# Altium schematic sheet 04-BLE.SchDoc: BLE Transreciver
size A3; DocumentNumber: 4; SheetNumber: 4; SheetTotal: 15
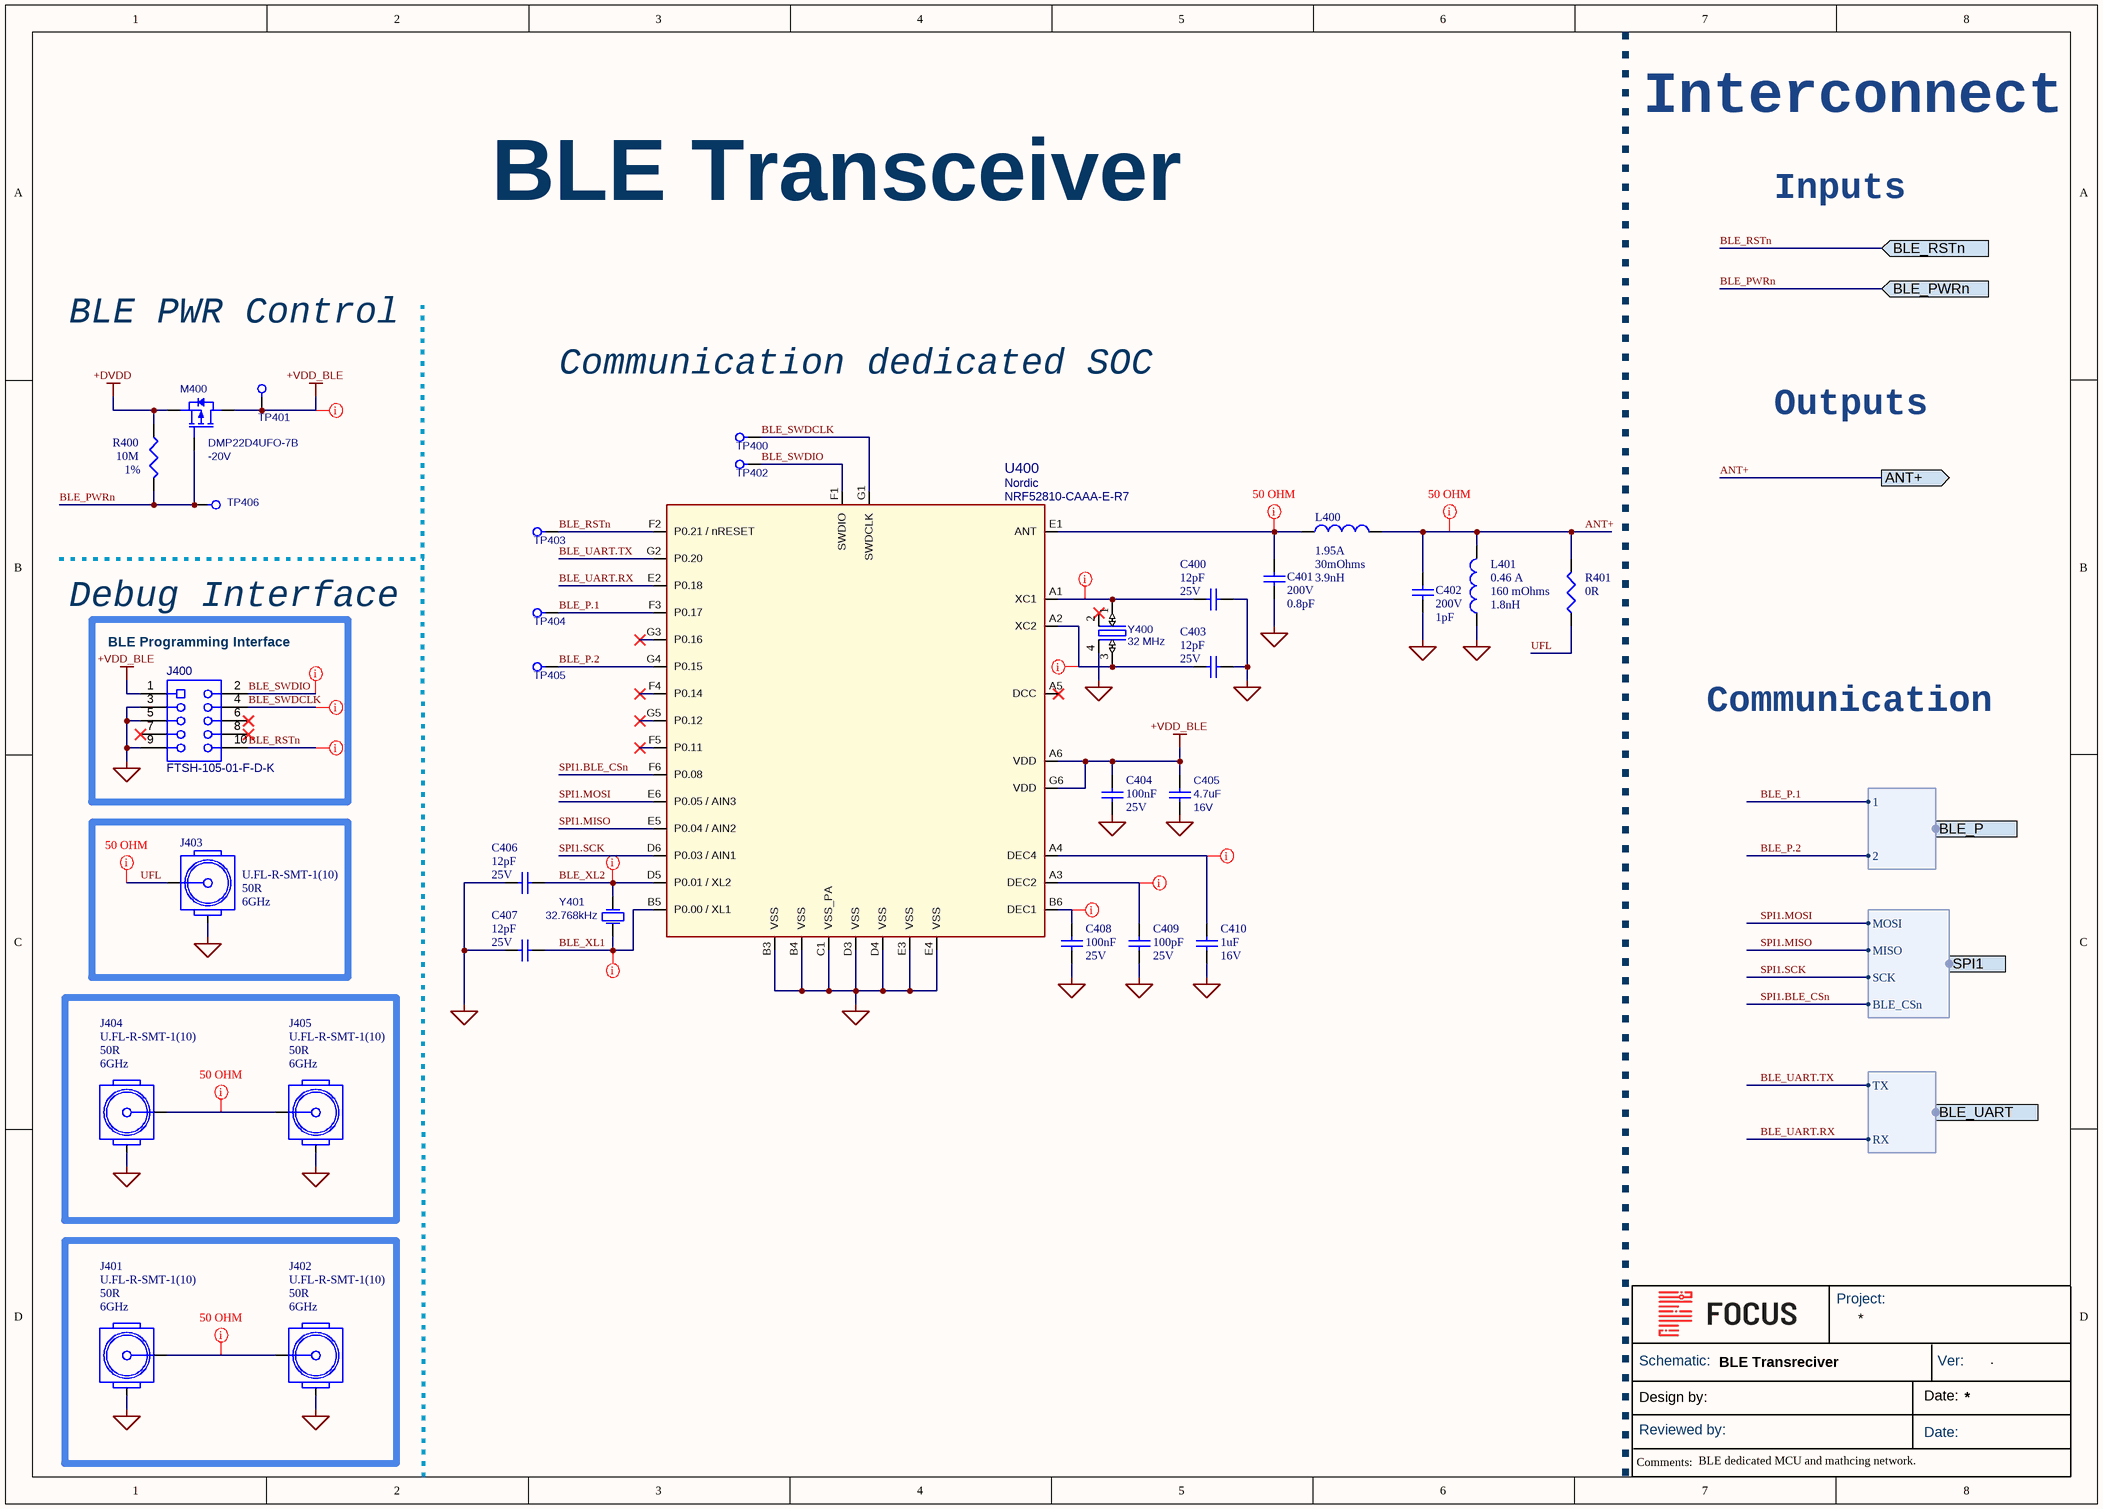
[diagram p0: 04-BLE.SchDoc]

## Parts
C400  value 12pF  Rated DC Voltage (URdc): 25V  [C0201_C]  (hidden comment: GRM0335C1E120JA01D)
C401  value 0.8pF  Voltage Rating: 200V  [CAP0402_REDUCED]  (hidden comment: 600L0R8AT200T)
C402  value 1pF  Voltage Rating: 200V  [CAP0402_REDUCED]  (hidden comment: 600L1R0AT200T)
C403  value 12pF  Rated DC Voltage (URdc): 25V  [C0201_C]  (hidden comment: GRM0335C1E120JA01D)
C404  value 100nF  Rated DC Voltage (URdc): 25V  [C0201_C]  (hidden comment: GRM033R61E104KE14J)
C405  value 4.7uF  Rating: 16V  [CAP0603_REDUCED]  (hidden comment: GRM188R61C475KE11)
C406  value 12pF  Rated DC Voltage (URdc): 25V  [C0201_C]  (hidden comment: GRM0335C1E120JA01D)
C407  value 12pF  Rated DC Voltage (URdc): 25V  [C0201_C]  (hidden comment: GRM0335C1E120JA01D)
C408  value 100nF  Rated DC Voltage (URdc): 25V  [C0201_C]  (hidden comment: GRM033R61E104KE14J)
C409  value 100pF  Rated DC Voltage (URdc): 25V  [C0201_C]  (hidden comment: GRM033R71E101KA01D)
C410  value 1uF  Rated DC Voltage (URdc): 16V  [C0201_C]  (hidden comment: GRM033R61C105ME15D)
J400  FTSH-105-01-F-D-K  [SAMTEC_FTSH-105-01-XXX-D-K]
J401  U.FL-R-SMT-1(10)  Characteristic Impedance: 50R  Operating Frequency-Max: 6GHz  [FP-U_FL-R-SMT-1_10-MFG]
J402  U.FL-R-SMT-1(10)  Characteristic Impedance: 50R  Operating Frequency-Max: 6GHz  [FP-U_FL-R-SMT-1_10-MFG]
J403  U.FL-R-SMT-1(10)  Characteristic Impedance: 50R  Operating Frequency-Max: 6GHz  [FP-U_FL-R-SMT-1_10-MFG]
J404  U.FL-R-SMT-1(10)  Characteristic Impedance: 50R  Operating Frequency-Max: 6GHz  [FP-U_FL-R-SMT-1_10-MFG]
J405  U.FL-R-SMT-1(10)  Characteristic Impedance: 50R  Operating Frequency-Max: 6GHz  [FP-U_FL-R-SMT-1_10-MFG]
L400  value 3.9nH  Current Rating: 1.95A  DC Resistance: 30mOhms  [L0402_C]  (hidden comment: LQW15AN3N9G80D)
L401  value 1.8nH  Current Rating: 0.46 A  DC Resistance: 160 mOhms  [L0402_C]  (hidden comment: LQW15AN1N8C00D)
M400  Rating: -20V  [DIODESINC_X2-DFN0604-3]  (hidden comment: DMP22D4UFO-7B)
R400  value 10M  Tolerance: 1%  [R0201_C]  (hidden comment: CRCW020110M0FNED)
R401  value 0R  [R0201_C]  (hidden comment: PA0201-R-070RL)
TP400  Test Point  [testpad_0.9mm]  (value not drawn)  (no BOM)
TP401  Test Point  [testpad_0.9mm]  (value not drawn)  (no BOM)
TP402  Test Point  [testpad_0.9mm]  (value not drawn)  (no BOM)
TP403  Test Point  [testpad_0.9mm]  (value not drawn)  (no BOM)
TP404  Test Point  [testpad_0.9mm]  (value not drawn)  (no BOM)
TP405  Test Point  [testpad_0.9mm]  (value not drawn)  (no BOM)
TP406  Test Point  [testpad_0.9mm]  (value not drawn)  (no BOM)
U400  Manufacturer: Nordic  [NORDIC_WLCSP_2.482x2.464]  (hidden comment: NRF52810-CAAA-E-R7)
Y400  value 32 MHz  [XTAL_ECS-SMD-CRYSTAL-10-48-CKY-TR]  (hidden comment: ECS-320-10-48-CKY-TR)
Y401  value 32.768kHz  [MICROCRYSTAL_CC8V-T1A]  (hidden comment: CM8V-T1A-32.768KHZ-6PF-20PPM-TA-QC)

## Ports
ANT+ (out), BLE_P (harness BLE PINS), BLE_PWRn (in), BLE_RSTn (in), BLE_UART (harness UART), SPI1 (harness BLE_SPI)

## Harnesses
BLE_SPI: MOSI, MISO, BLE_CSn, SCK
BLE PINS: 1, 2
UART: TX, RX

## Nets
+DVDD: M400.2(S) R400.1
+VDD_BLE: C404.2 C405.1 J400.1 M400.3(D) TP401.1 U400.A6(VDD) U400.G6(VDD)
GND: C400.2 C401.1 C402.1 C403.2 C404.1 C405.2 C406.1 C407.1 C408.1 C409.1 C410.2 J400.3 J400.5 J400.9 J401.2 J402.2 J403.2 J404.2 J405.2 L401.1 U400.B3(VSS) U400.B4(VSS) U400.C1(VSS_PA) U400.D3(VSS) U400.D4(VSS) U400.E3(VSS) U400.E4(VSS) Y400.4(GND)
ANT+: C402.2 L400.2 L401.2 R401.2 ; port ANT+
BLE_P.1: TP404.1 U400.F3(P0.17) ; port BLE_P.1
BLE_P.2: TP405.1 U400.G4(P0.15) ; port BLE_P.2
BLE_PWRn: M400.1(G) R400.2 TP406.1 ; port BLE_PWRn
BLE_RSTn: J400.10 TP403.1 U400.F2(P0.21_/_nRESET) ; port BLE_RSTn
BLE_SWDCLK: J400.4 TP400.1 U400.G1(SWDCLK)
BLE_SWDIO: J400.2 TP402.1 U400.F1(SWDIO)
BLE_UART.RX: U400.E2(P0.18) ; port BLE_UART.RX
BLE_UART.TX: U400.G2(P0.20) ; port BLE_UART.TX
BLE_XL1: C407.2 U400.B5(P0.00_/_XL1) Y401.1
BLE_XL2: C406.2 U400.D5(P0.01_/_XL2) Y401.2
SPI1.BLE_CSn: U400.F6(P0.08) ; port SPI1.BLE_CSn
SPI1.MISO: U400.E5(P0.04_/_AIN2) ; port SPI1.MISO
SPI1.MOSI: U400.E6(P0.05_/_AIN3) ; port SPI1.MOSI
SPI1.SCK: U400.D6(P0.03_/_AIN1) ; port SPI1.SCK
UFL: J403.1 R401.1
NetC400_1: C400.1 U400.A1(XC1) Y400.1(IN/OUT)
NetC401_2: C401.2 L400.1 U400.E1(ANT)
NetC403_1: C403.1 U400.A2(XC2) Y400.3(OUT/IN)
NetC408_2: C408.2 U400.B6(DEC1)
NetC409_2: C409.2 U400.A3(DEC2)
NetC410_1: C410.1 U400.A4(DEC4)
NetJ401_1: J401.1 J402.1
NetJ404_1: J404.1 J405.1

Not connected (* = marked no-connect by the designer): J400 6* 7* 8*; U400 A5(DCC)* F4(P0.14)* F5(P0.11)* G3(P0.16)* G5(P0.12)*; Y400 2(NC)*

## Layout directives
net class 50_OHM; rule Impedance Constraint [Min = 50.00    Max = 50.00    ]: ANT+, NetC401_2, NetJ401_1, NetJ404_1, UFL
net class DIGITAL: BLE_RSTn, BLE_SWDCLK, BLE_SWDIO, BLE_XL1, BLE_XL2, NetC400_1, NetC403_1
rule Supply Nets [Voltage = 3.300]; net class POWER: +VDD_BLE, NetC408_2, NetC409_2, NetC410_1

## Notes on the sheet
- Interconnect
- BLE Transceiver
- Inputs
- BLE PWR Control
- Communication dedicated SOC
- Outputs
- Debug Interface
- (near J400) BLE Programming Interface
- Communication
- BLE dedicated MCU and mathcing network.
- Project:
- Schematic:
- Ver:
- .
- Design by:
- Reviewed by:
- Date:
- Comments:

## Library data of the parts
C400 C403 C406 C407 = GRM0335C1E120JA01D: Ceramic Capacitor, Multilayer, Ceramic, 25V, 5% +Tol, 5% -Tol, C0G, 30ppm/Cel TC, 0.000012uF, Surface Mount, 0201; Manufacturer: Murata; Multilayer: Yes; Category: Ceramic Capacitors; Supplier: Digikey; Supplier Part Number: 490-3144-1-ND; Manufacturer Part Number: GRM0335C1E120JA01D; RoHS: Yes; Stock: 4384132; Pricing: 1=0,1, 10=0,011, 50=0,0062, 100=0,0048, 500=0,0036, 1000=0,00283, 2500=0,00258, 5000=0,00237 (USD); Mounting Technology: Surface Mount; Pins: 2; Dielectric Material: Ceramic; Package Shape: Rectangular; Case/Package: 0201; Terminal Finish: Nickel; Min Operating Temperature: -55°C; Max Operating Temperature: 125°C; Termination: Wraparound; JESD-609 Code: e3; Capacitor Type: Ceramic; Tolerance  (fill in as +-): 5%; Packaging: Tape and Reel; Tolerance (fill in as +-): 5%; Temperature Characteristics Code: C0G; Reach SVHC Compliant: Yes; RoHS Compliant: Yes; ComponentLink1URL: https://datasheet.ciiva.com:443/pdfs/VipMasterIC/IC/MURE/MURE-S-A0004347008/MURE-S-A0004348737-1.pdf?src-supplier=IHS+Markit; ComponentLink1Description: https://datasheet.ciiva.com:443/pdfs/VipMasterIC/IC/MURE/MURE-S-A0004347008/MURE-S-A0004348737-1.pdf?src-supplier=IHS+Markit; Supplier 1: Arrow Electronics; Supplier Part Number 1: GRM0335C1E120JA01D
C401 = 600L0R8AT200T: Capacitor, 0.8pF, Silicon RF, 200V, Tolerance 0.05pF, 0402, Implant-grade; Manufacturer: Kyocera AVX; Medical Grade Manufacturer: TBD; Temperature Coefficient: 30 ppm/°C; Category: Capacitor; Manufacturer Part Number: 600L0R8AT200T; Medical Grade Manufacturer Part Number: TBD; Size Code: 0402; Supplier: TBD; Supplier Part Number: TBD; Height: 0.6mm; Width: 0.51mm; Length: 1.05mm; Tolerance: 0.05pF; Dielectric: -; Supplier 1: Mouser; Supplier Part Number 1: 581-600L0R8AT
C402 = 600L1R0AT200T: Capacitor, 1pF, RF Capacitors, 200V, Tolerance 0.01pF, 0402, Implant-grade; Manufacturer: Kyocera AVX; Medical Grade Manufacturer: TBD; Temperature Coefficient: 30 ppm/°C; Category: Capacitor; Manufacturer Part Number: 600L1R0AT200T; Medical Grade Manufacturer Part Number: TBD; Size Code: 0402; Supplier: TBD; Supplier Part Number: TBD; Height: 0.6mm; Width: 0.51mm; Length: 1.02mm; Tolerance: 0.01pF; Dielectric: -; Supplier 1: Mouser; Supplier Part Number 1: 581-600L1R0AT
C404 C408 = GRM033R61E104KE14J: Ceramic Capacitor, Multilayer, Ceramic, 25V, 10% +Tol, 10% -Tol, X5R, 15% TC, 0.1uF, Surface Mount, 0201; Manufacturer: Murata; Multilayer: Yes; Category: Ceramic Capacitors; Supplier: Digikey; Supplier Part Number: 490-14571-1-ND; Manufacturer Part Number: GRM033R61E104KE14J; RoHS: Yes; Stock: 1540851; Pricing: 1=0,1, 10=0,033, 50=0,0192, 100=0,0148, 500=0,01118, 1000=0,00878, 2500=0,00798, 5000=0,00734 (USD); Mounting Technology: Surface Mount; Pins: 2; Dielectric Material: Ceramic; Package Shape: Rectangular; Case/Package: 0201; Terminal Finish: Nickel; Min Operating Temperature: -55°C; Max Operating Temperature: 85°C; JESD-609 Code: e3; Capacitor Type: Ceramic; Tolerance  (fill in as +-): 10%; Package Style: SMTMeter; Packaging: Tape and Reel; Tolerance (fill in as +-): 10%; Temperature Characteristics Code: X5R; Termination: Wraparound; Length: 0.6mm; Width: 0.3mm; Height: 0.3mm; Reach SVHC Compliant: Yes; RoHS Compliant: Yes; ComponentLink1URL: https://psearch.en.murata.com:443/capacitor/product/GRM033R61E104KE14%23.pdf?src-supplier=IHS+Markit; ComponentLink1Description: https://psearch.en.murata.com:443/capacitor/product/GRM033R61E104KE14%23.pdf?src-supplier=IHS+Markit; ComponentLink2URL: http://www.mouser.com/ds/2/281/c02e-2905.pdf?src-supplier=Mouser; ComponentLink2Description: http://www.mouser.com/ds/2/281/c02e-2905.pdf?src-supplier=Mouser; ComponentLink3URL: http://search.murata.co.jp/Ceramy/image/img/A01X/G101/ENG/GRM033R61E104KE14-01.pdf?src-supplier=Digikey; ComponentLink3Description: http://search.murata.co.jp/Ceramy/image/img/A01X/G101/ENG/GRM033R61E104KE14-01.pdf?src-supplier=Digikey; ComponentLink4URL: https://search.murata.co.jp/Ceramy/image/img/A01X/G101/ENG/GRM033R61E104KE14-01.pdf?src-supplier=Digikey; ComponentLink4Description: https://search.murata.co.jp/Ceramy/image/img/A01X/G101/ENG/GRM033R61E104KE14-01.pdf?src-supplier=Digikey; Supplier 1: Arrow Electronics; Supplier Part Number 1: GRM033R61E104KE14J
C405 = GRM188R61C475KE11: Capacitor, 4.7uF, X5R, 16V, 10%, 0603, Implant-grade; Manufacturer: Murata; Medical Grade MFR PN: GCH188R61C475KE11; Length (mm): 1.60 ±0.10; Medical Grade MFR: Murata; PCB Footprint: cap0603_reduced; Thickness (mm): 0.80 ±0.10; Width (mm): 0.80 ±0.10; Category: Capacitor; Package Description: 0603; Check: *; Supplier 1: Arrow Electronics; Supplier Part Number 1: GRM188R61C475KE11D; Status: *; Review: *; Manufacturer Part Number: GRM188R61C475KE11
C409 = GRM033R71E101KA01D: Ceramic Capacitor, Multilayer, Ceramic, 25V, 10% +Tol, 10% -Tol, X7R, 15% TC, 0.0001uF, Surface Mount, 0201; Manufacturer: Murata; Multilayer: Yes; Category: Ceramic Capacitors; Supplier: Digikey; Supplier Part Number: 490-3172-1-ND; Manufacturer Part Number: GRM033R71E101KA01D; RoHS: Yes; Stock: 605708; Pricing: 1=0,1, 10=0,01, 50=0,0056, 100=0,0043, 500=0,00324, 1000=0,00255, 2500=0,00232, 5000=0,00213 (USD); Mounting Technology: Surface Mount; Pins: 2; Dielectric Material: Ceramic; Package Shape: Rectangular; Case/Package: 0201; Terminal Finish: Nickel; Min Operating Temperature: -55°C; Max Operating Temperature: 125°C; JESD-609 Code: e3; Capacitor Type: Ceramic; Tolerance  (fill in as +-): 10%; Package Style: SMTMeter; Packaging: Tape and Reel; Tolerance (fill in as +-): 10%; Temperature Characteristics Code: X7R; Termination: Wraparound; Length: 0.6mm; Width: 0.3mm; Height: 0.3mm; Reach SVHC Compliant: Yes; RoHS Compliant: Yes; ComponentLink1URL: https://psearch.en.murata.com:443/capacitor/product/GRM033R71E101KA01%23.pdf?src-supplier=IHS+Markit; ComponentLink1Description: https://psearch.en.murata.com:443/capacitor/product/GRM033R71E101KA01%23.pdf?src-supplier=IHS+Markit; ComponentLink2URL: https://datasheet.ciiva.com/129/grm033r71e101ka01-01-129915.pdf?src-supplier=Digikey; ComponentLink2Description: https://datasheet.ciiva.com/129/grm033r71e101ka01-01-129915.pdf?src-supplier=Digikey; ComponentLink3URL: https://datasheet.ciiva.com/129/grm033r71e101ka01-01-129916.pdf?src-supplier=Digikey; ComponentLink3Description: https://datasheet.ciiva.com/129/grm033r71e101ka01-01-129916.pdf?src-supplier=Digikey; ComponentLink4URL: https://datasheet.ciiva.com/129/grm033r71e101ka01-01-129917.pdf?src-supplier=Digikey; ComponentLink4Description: https://datasheet.ciiva.com/129/grm033r71e101ka01-01-129917.pdf?src-supplier=Digikey; ComponentLink5URL: https://datasheet.ciiva.com/18184/getdatasheetpartid-228478-18184102.pdf?src-supplier=Verical; ComponentLink5Description: https://datasheet.ciiva.com/18184/getdatasheetpartid-228478-18184102.pdf?src-supplier=Verical; ComponentLink6URL: https://datasheet.ciiva.com/29199/455792-da-01-en-vs-kondensator-0201-29199171.pdf?src-supplier=Conrad; ComponentLink6Description: https://datasheet.ciiva.com/29199/455792-da-01-en-vs-kondensator-0201-29199171.pdf?src-supplier=Conrad; ComponentLink7URL: https://datasheet.ciiva.com/11605/product-11605541.pdf?src-supplier=Avnet; ComponentLink7Description: https://datasheet.ciiva.com/11605/product-11605541.pdf?src-supplier=Avnet; ComponentLink8URL: https://datasheet.ciiva.com/16370/product-16370826.pdf?src-supplier=Future+Electronics; ComponentLink8Description: https://datasheet.ciiva.com/16370/product-16370826.pdf?src-supplier=Future+Electronics; Supplier 1: Arrow Electronics; Supplier Part Number 1: GRM033R71E101KA01D
C410 = GRM033R61C105ME15D: Ceramic Capacitor, Multilayer, Ceramic, 16V, 20% +Tol, 20% -Tol, X5R, 15% TC, 1uF, Surface Mount, 0201; Manufacturer: Murata; Category: Ceramic Capacitors; Supplier: Digikey; Supplier Part Number: 490-18654-1-ND; Manufacturer Part Number: GRM033R61C105ME15D; RoHS: No; Stock: 132893; Pricing: 1=0,16, 10=0,105, 50=0,0628, 100=0,0493, 500=0,03644, 1000=0,03017, 2500=0,02808, 5000=0,02569 (USD); Supplier 1: Avnet; Supplier Part Number 1: GRM033R61C105ME15D
J400 = FTSH-105-01-F-D-K: Connector, 1.27 mm, 2x5, Male, TH; Manufacturer: Samtec; Review: 020823; Value: FTSH-105-01-F-D-K; Supplier 1: Mouser; Supplier Part Number 1: 200-FTSH10501FDK; Status: Approved; Manufacturer Part Number: FTSH-105-01-F-D-K
J401-J405 = U.FL-R-SMT-1(10): RF Connector, 1 Contact(s), Male, Board Mount, Surface Mount Terminal, Receptacle; pin to pad: 2>2+3; Manufacturer: Hirose; Durability: 30Cycles; Insulation Resistance: 500MR; Number of Ports: 1; Option: General Purpose; Contact Resistance: 20mR; Contact Style: Coax; Coupling Type: Snap; Dielectric Withstanding Voltage (AC): 200V; Filter Feature: No; Mating Information: MULTIPLE MATING PARTS AVAILABLE; Panel Mount: No; VSWR: 1.5; Insertion Loss: 0.05dB; Body Depth: 0.098inch; Mounting Option 1: LOCKING; Body Diameter: 0.079inch; Reference Standard: UL; Reliability: COMMERCIAL; Supplier: Digi-Key; Supplier Part Number: H11891CT-ND; RoHS: Yes; Category: RF / Coaxial Connectors; Stock: 112692; Pricing: 1=1,35, 10=1,138, 25=1,092, 50=1,0686, 100=1,0221, 250=0,9292, 500=0,83628, 1000=0,74336 (USD); Mounting Technology: Board; Insulation Material: Polymer; Shell Finish: Silver; Shell Material: CuSn; Contact Material: Bronze; Contact Finish - Mating: GOLD; Contact Finish - Termination: GOLD; Insulation Color: Beige; Min Operating Temperature: -40°C; Max Operating Temperature: 90°C; Connector Type: RF CONNECTOR; Body/Shell Style: RECEPTACLE; Contact Gender: Male; Mounting Style: STRAIGHT; Termination: SMD/SMT; Number of Contacts: 1; JESD-609 Code: e4; Reach SVHC Compliant: Yes; RoHS Compliant: Yes; DIN Conformance: No; IEC Conformance: No; MIL Conformance: No; ComponentLink1URL: https://datasheet.ciiva.com:443/pdfs/VipMasterIC/IC/HIRO/HIROS10696/HIROS08829-1.pdf?src-supplier=IHS+Markit; ComponentLink1Description: https://datasheet.ciiva.com:443/pdfs/VipMasterIC/IC/HIRO/HIROS10696/HIROS08829-1.pdf?src-supplier=IHS+Markit; ComponentLink2URL: https://datasheet.ciiva.com/11762/0900766b8105243f-11762474.pdf?src-supplier=Rs; ComponentLink2Description: https://datasheet.ciiva.com/11762/0900766b8105243f-11762474.pdf?src-supplier=Rs; ComponentLink3URL: https://datasheet.ciiva.com/7651/91524-7651914.pdf?src-supplier=Element14; ComponentLink3Description: https://datasheet.ciiva.com/7651/91524-7651914.pdf?src-supplier=Element14; ComponentLink4URL: https://datasheet.ciiva.com/7651/91524-7651915.pdf?src-supplier=Element14; ComponentLink4Description: https://datasheet.ciiva.com/7651/91524-7651915.pdf?src-supplier=Element14; Manufacturer Part Number: U.FL-R-SMT-1(10); Supplier 1: Digikey; Supplier Part Number 1: H11891CT-ND
L400 = LQW15AN3N9G80D: Inductor, 3.9nH, 1.95A, 2%, 0402; Manufacturer: Murata; Medical Grade Manufacturer: TBD; Shielding: Unshielded; Category: Inductor; Temperature Coefficient: -; Manufacturer Part Number: LQW15AN3N9G80D; Medical Grade Manufacturer Part Number: TBD; Size Code: 0402; Supplier: TBD; Supplier Part Number: TBD; Height: 0.5mm; Width: 0.6mm; Length: 1mm; Tolerance: 2%; Current Saturation: -; Supplier 1: Mouser; Supplier Part Number 1: 81-LQW15AN3N9G80D; Supplier 2: Digikey; Supplier Part Number 2: 490-LQW15AN3N9G80DCT-ND; Supplier 3: Digikey; Supplier Part Number 3: 490-LQW15AN3N9G80DDKR-ND; Supplier 4: Digikey; Supplier Part Number 4: 490-LQW15AN3N9G80DTR-ND
L401 = LQW15AN1N8C00D: Inductor, 1.8nH, 0.46A, Tolerance 0.2 nH, 0402; Manufacturer: Murata; Medical Grade Manufacturer: TBD; Tolerance: 0.2 nH; Shielding: Unshielded; Category: Inductor; Temperature Coefficient: -; Manufacturer Part Number: LQW15AN1N8C00D; Medical Grade Manufacturer Part Number: TBD; Size Code: 0402; Supplier: TBD; Supplier Part Number: TBD; Height: 0.5mm; Width: 0.6mm; Length: 1mm; Current Saturation: -; Supplier 1: Mouser; Supplier Part Number 1: 81-LQW15AN1N8C00D; Supplier 2: Digikey; Supplier Part Number 2: 490-14479-1-ND; Supplier 3: Digikey; Supplier Part Number 3: 490-14479-6-ND; Supplier 4: Digikey; Supplier Part Number 4: 490-14479-2-ND
M400 = DMP22D4UFO-7B: MOSFET, P-chan, -20V, -383mA, DFN0604; Manufacturer: Diodes Inc; Medical Grade MFR: TBD; Review: 020823; Category: Transistor; Length (mm): 0.60 ±0.05; Medical Grade MFR PN: TBD; PCB Footprint: TBD; Thickness (mm): 0.36 ±0.04; Value: DMP22D4UFO-7B; Width (mm): 0.40 ±0.05; Supplier 1: Digi-Key; Supplier Part Number 1: 31-DMP22D4UFO-7BCT-ND; Status: Approved; Manufacturer Part Number: DMP22D4UFO-7B
R400 = CRCW020110M0FNED: Fixed Resistor, Metal Glaze/thick Film, 0.05W, 10000000ohm, 30V, 1% +/-Tol, 200ppm/Cel, Surface Mount, 0201; Manufacturer: Vishay Draloric; Medical Grade MFR: Mini-Systems; Medical Grade MFR PN: MWA96SM-1005F-NS62TR; Power: 50mW; Rated Temperature: 70°C; Temperature Coefficient: 200ppm/°C; Category: Chip SMD Resistors; Supplier: Mouser; Supplier Part Number: 71-CRCW020110M0FNED; Manufacturer Part Number: CRCW020110M0FNED; RoHS: Yes; Stock: 159754; Pricing: 1=0,1, 10=0,024, 50=0,024, 100=0,014, 1000=0,011, 10000=0,006 (USD); Mounting Technology: Surface Mount; Pins: 2; Package Shape: Rectangular; Case/Package: 0201; Terminal Finish: Nickel; Min Operating Temperature: -55°C; Max Operating Temperature: 155°C; JESD-609 Code: e3; Resistor Type: FIXED RESISTOR; Packaging: Tape and Reel; Technology: METAL GLAZE/THICK FILM; Termination: Wraparound; Working Voltage: 30V; Reach SVHC Compliant: Yes; RoHS Compliant: Yes; ComponentLink1URL: https://datasheet.ciiva.com:443/pdfs/VipMasterIC/IC/VISH/VISH-S-A0002932828/VISH-S-A0002932828-1.pdf?src-supplier=IHS+Markit; ComponentLink1Description: https://datasheet.ciiva.com:443/pdfs/VipMasterIC/IC/VISH/VISH-S-A0002932828/VISH-S-A0002932828-1.pdf?src-supplier=IHS+Markit; ComponentLink2URL: https://datasheet.ciiva.com/7673/1719906-7673177.pdf?src-supplier=Element14; ComponentLink2Description: https://datasheet.ciiva.com/7673/1719906-7673177.pdf?src-supplier=Element14; ComponentLink3URL: https://datasheet.ciiva.com/7673/1719906-7673178.pdf?src-supplier=Element14; ComponentLink3Description: https://datasheet.ciiva.com/7673/1719906-7673178.pdf?src-supplier=Element14; ComponentLink4URL: https://datasheet.ciiva.com/22692/1719906-22692711.pdf?src-supplier=Element14; ComponentLink4Description: https://datasheet.ciiva.com/22692/1719906-22692711.pdf?src-supplier=Element14; ComponentLink5URL: https://datasheet.ciiva.com/22665/1700795-22665701.pdf?src-supplier=Element14; ComponentLink5Description: https://datasheet.ciiva.com/22665/1700795-22665701.pdf?src-supplier=Element14; Supplier 1: Digikey; Supplier Part Number 1: 541-CRCW020110M0FNEDCT-ND
R401 = PA0201-R-070RL: Resistor, 0 Ohm, 0201, Metal element, Non-Implant grade,; Manufacturer: YAGEO; Temperature Coefficient: 150 ppm/°C; Category: Resistor; Manufacturer Part Number: PA0201-R-070RL; Medical Grade Manufacturer: -; Medical Grade Manufacturer Part Number: -; Size Code: 0201; Supplier: TBD; Supplier Part Number: TBD; Voltage Rating: *
TP400-TP406 = Test Point: Test pad, 0.90mm circular pad; PCB Footprint: testpad_0p90mm; Length (mm): 0.90; Manufacturer: N/A; Manufacturer PN: N/A; Medical Grade MFR: N/A; Medical Grade MFR PN: N/A; Rating: N/A; Thickness (mm): N/A; Value: Test point; Width (mm): 0.90; Category: Test point; Status: *; Review: *
U400 = NRF52810-CAAA-E-R7: Bluetooth radio, v5.0, 192 kB Flash, 24 kB RAM, BGA-33; Medical Grade MFR: TBD; Category: IC; Length (mm): 2.48; Medical Grade MFR PN: TBD; Package Description: TBD; PCB Footprint: TBD; Rating: TBD; Thickness (mm): 0.48 ±0.06; Value: NRF52810-CAAA-E-R7; Width (mm): 2.46; Supplier 1: DigiKey; Supplier Part Number 1: 4823-NRF52810-CAAA-E-R7CT-ND; Status: *; Review: *; Manufacturer Part Number: NRF52810-CAAA-E-R7
Y400 = ECS-320-10-48-CKY-TR: 32 MHz Â±10ppm Crystal 10pF 100 Ohms 4-SMD, No Lead; Manufacturer: ECS Inc.; Medical Grade MFR: TBD; Category: Crystal; Length (mm): 1.20; Medical Grade MFR PN: TBD; PCB Footprint: TBD; Rating: N/A; Thickness (mm): 0.33; Width (mm): 1.00; Package Description: 4-SMD, No Lead; Supplier 1: Digi-Key; Supplier Part Number 1: XC3036CT-ND; Status: *; Review: *; Manufacturer Part Number: ECS-320-10-48-CKY-TR
Y401 = CM8V-T1A-32.768KHZ-6PF-20PPM-TA-QC: CRYSTAL 32.7680KHZ 6PF SMD; Manufacturer: Micro Crystal; Medical Grade MFR PN: CC8V-T1A32.768kHz6.0pF±20ppmTAQM; PCB Footprint: TBD; Review: 020823; Category: Crystal; Length (mm): 2.00; Medical Grade MFR: Micro Crystal; Rating: N/A; Thickness (mm): 0.67; Width (mm): 1.20; Package Description: CC8V; Supplier 1: Digi-Key; Supplier Part Number 1: 2195-CM8V-T1A-32.768KHZ-6PF-20PPM-TA-QCCT-ND; Status: Approved; Manufacturer Part Number: CM8V-T1A-32.768KHZ-6PF-20PPM-TA-QC